# Altium schematic sheet TI_DS26C31T.SchDoc
size A4; CompanyName: Technische Hochschule Nürnberg Georg Simon Ohm; Address1: Fürther Straße 250; Address2: 90429 Nürnberg; Address3: GERMANY; DocumentNumber: 7; SheetNumber: 7; SheetTotal: 16; CompanyName2: Institut ELSYS
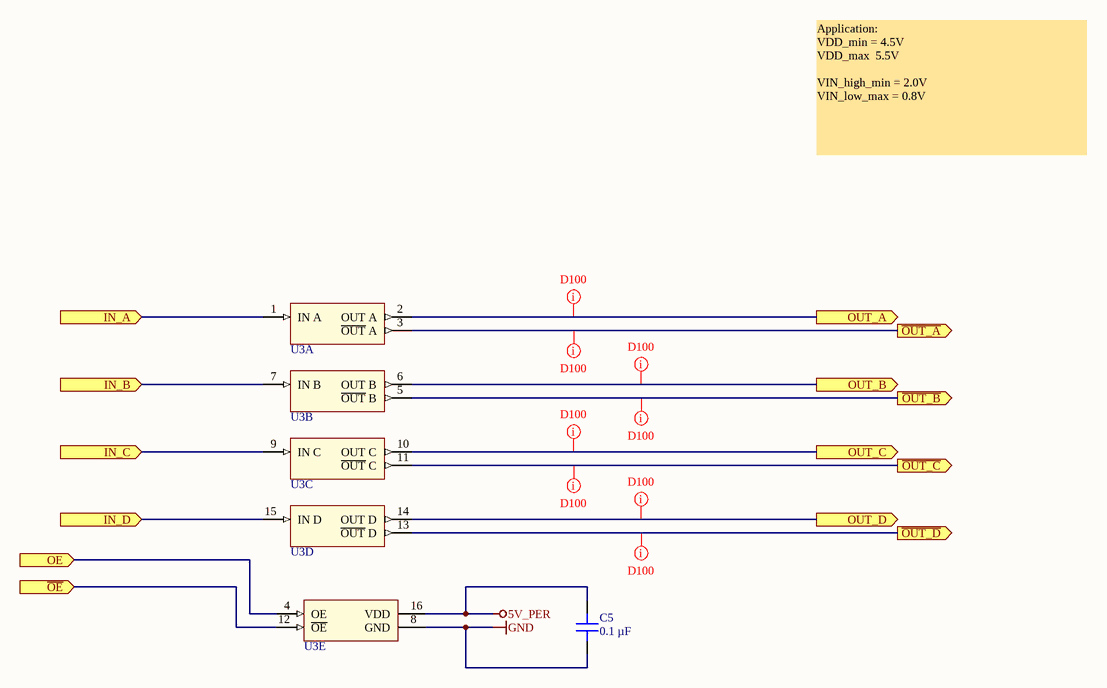
[diagram p0: TI_DS26C31T.SchDoc]

## Parts
C5  0.1 µF  [C_0603]
U3  DS26C31TMX/NOPB  [TI_D-R-PDSO-G16_N]  (value not drawn)  (parts A,B,C,D,E of 5)

## Ports
IN_A (in), IN_B (in), IN_C (in), IN_D (in), OE (in), OUT_A (out), OUT_B (out), OUT_C (out), OUT_D (out), ~{OE} (in), ~{OUT_A} (out), ~{OUT_B} (out), ~{OUT_C} (out), ~{OUT_D} (out)

## Nets
5V_PER: C5.2 U3.16(VDD)
GND: C5.1 U3.8(GND)
IN_A: U3.1(IN_A) ; port IN_A
IN_B: U3.7(IN_B) ; port IN_B
IN_C: U3.9(IN_C) ; port IN_C
IN_D: U3.15(IN_D) ; port IN_D
~{OE}: U3.12(~{OE}) ; port ~{OE}
~{OUT_A}: U3.3(~{OUT}_A) ; port ~{OUT_A}
~{OUT_B}: U3.5(~{OUT}_B) ; port ~{OUT_B}
~{OUT_C}: U3.11(~{OUT}_C) ; port ~{OUT_C}
~{OUT_D}: U3.13(~{OUT}_D) ; port ~{OUT_D}
OE: U3.4(OE) ; port OE
OUT_A: U3.2(OUT_A) ; port OUT_A
OUT_B: U3.6(OUT_B) ; port OUT_B
OUT_C: U3.10(OUT_C) ; port OUT_C
OUT_D: U3.14(OUT_D) ; port OUT_D

## Layout directives
net class D100: OUT_A, OUT_B, OUT_C, OUT_D, ~{OUT_A}, ~{OUT_B}, ~{OUT_C}, ~{OUT_D}

## Notes on the sheet
- Application:
  VDD_min = 4.5V
  VDD_max  5.5V
  VIN_high_min = 2.0V
  VIN_low_max = 0.8V
- Title
- Size:
- Date:
- A4
- Revision:
- Time:
- Sheet
- of
- Author:
- Project:

## Library data of the parts
C5 = C0603X104K5RAC7411: Capacitor 0603, 50 VDC, 0.1 µF, X7R; Manufacturer: KEMET; Tolerance: 10 %; Voltage Rating: 50 VDC; Created from: MGremer; Manufacturer Part Number: C0603X104K5RAC7411; PartID: 3; Created On: 20.12.2020 13:54:13; ComponentLink1Description: Datasheet; ComponentLink1URL: https://www.mouser.de/datasheet/2/212/1/KEM_C1013_X7R_FT_CAP_SMD-1103280.pdf; Component Type: Capacitor 0603; Device Package: 0603; Last Updated: 04.03.2021 09:24:28; Mounting Type: SMD; Operating Temperature: -55 - 125°C; Series: SMD Comm X7R Flex; Supplier 1: Mouser; Supplier Part Number 1: 80-C0603X104K5R7411; Type: Capacitor; Value: 0.1 µF; Live Cycle Status: 1; Stock number: Labor SMD Container; LCSC Part Number: C14663; Supplier 2: LCSC; Supplier Part Number 2: C14663
U3 = DS26C31TMX/NOPB: CMOS Quad Tri-State Differential Line Drivers, 16-pin Narrow SOIC, Pb-Free; Manufacturer: Texas Instruments; Created from: T. Wendt; PartID: 1; Created On: 01.03.2021 10:08:45; ComponentLink1Description: Datasheet; ComponentLink1URL: http://www.ti.com/general/docs/lit/getliterature.tsp?genericPartNumber=DS26C31T&fileType=pdf; Component Type: RS422 Driver; Device Package: SOIC; Last Updated: 04.03.2021 09:04:43; Manufacturer Part Number: DS26C31TMX/NOPB; Minimum Order: 1; Mounting Type: SMD; Operating Temperature: -40°C - 85°C; Series: DS26C31; Supplier 1: Digi-Key; Supplier Part Number 1: DS26C31TMX/NOPBCT-ND; Supplier 2: Mouser; Supplier Part Number 2: 926-DS26C31TMX/NOPB; Type: Standard; Live Cycle Status: 1; LCSC Part Number: C132085; Stock number: not stored; Supplier 3: LCSC; Supplier Part Number 3: C132085